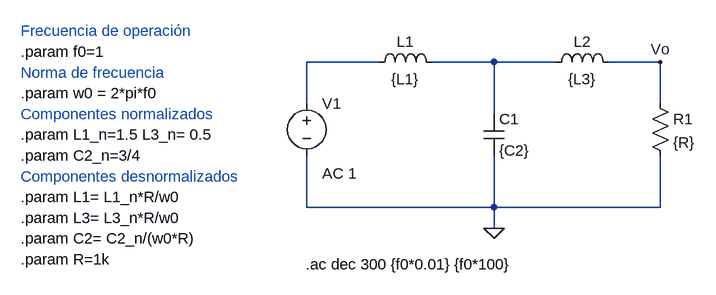
[diagram p0: schematic ej2.asc]
ej2.asc, the LTspice schematic file:
Version 4
SHEET 1 880 680
WIRE 176 80 64 80
WIRE 352 80 256 80
WIRE 448 80 352 80
WIRE 608 80 528 80
WIRE 64 144 64 80
WIRE 608 144 608 80
WIRE 352 160 352 80
WIRE 64 304 64 224
WIRE 352 304 352 224
WIRE 352 304 64 304
WIRE 608 304 608 224
WIRE 608 304 352 304
WIRE 352 336 352 304
FLAG 352 336 0
FLAG 608 80 Vo
SYMBOL voltage 64 128 R0
WINDOW 123 24 124 Left 2
WINDOW 39 0 0 Left 0
SYMATTR InstName V1
SYMATTR Value ""
SYMATTR Value2 AC 1
SYMBOL ind 160 96 R270
WINDOW 0 32 56 VTop 2
WINDOW 3 5 56 VBottom 2
SYMATTR InstName L1
SYMATTR Value {L1}
SYMBOL ind 432 96 R270
WINDOW 0 32 56 VTop 2
WINDOW 3 5 56 VBottom 2
SYMATTR InstName L2
SYMATTR Value {L3}
SYMBOL cap 336 160 R0
SYMATTR InstName C1
SYMATTR Value {C2}
SYMBOL res 592 128 R0
SYMATTR InstName R1
SYMATTR Value {R}
TEXT 62 392 Left 2 !.ac dec 300 {f0*0.01} {f0*100}
TEXT -376 32 Left 2 ;Frecuencia de operación
TEXT -376 64 Left 2 !.param f0=1
TEXT -376 96 Left 2 ;Norma de frecuencia
TEXT -376 128 Left 2 !.param w0 = 2*pi*f0
TEXT -376 160 Left 2 ;Componentes normalizados
TEXT -376 192 Left 2 !.param L1_n=1.5 L3_n= 0.5
TEXT -376 224 Left 2 !.param C2_n=3/4
TEXT -376 256 Left 2 ;Componentes desnormalizados
TEXT -376 288 Left 2 !.param L1= L1_n*R/w0
TEXT -376 320 Left 2 !.param L3= L3_n*R/w0
TEXT -376 352 Left 2 !.param C2= C2_n/(w0*R)
TEXT -376 384 Left 2 !.param R=1k

The netlist it stands for:
* ej2.asc
V1 N001 0 AC 1
L1 N001 N002 {L1}
L2 N002 Vo {L3}
C1 N002 0 {C2}
R1 Vo 0 {R}
.ac dec 300 {f0*0.01} {f0*100}
* Frecuencia de operación
.param f0=1
* Norma de frecuencia
.param w0 = 2*pi*f0
* Componentes normalizados
.param L1_n=1.5 L3_n= 0.5
.param C2_n=3/4
* Componentes desnormalizados
.param L1= L1_n*R/w0
.param L3= L3_n*R/w0
.param C2= C2_n/(w0*R)
.param R=1k
.backanno
.end